# EasyEDA schematic SCH_Mesa Endstops_2022-06-12.json
TITLE: Sheet_1; REV: 1.0; Date: 2022-06-12; Sheet: 1/1; Drawn By: Edward Niedziejko; Company: Your Company
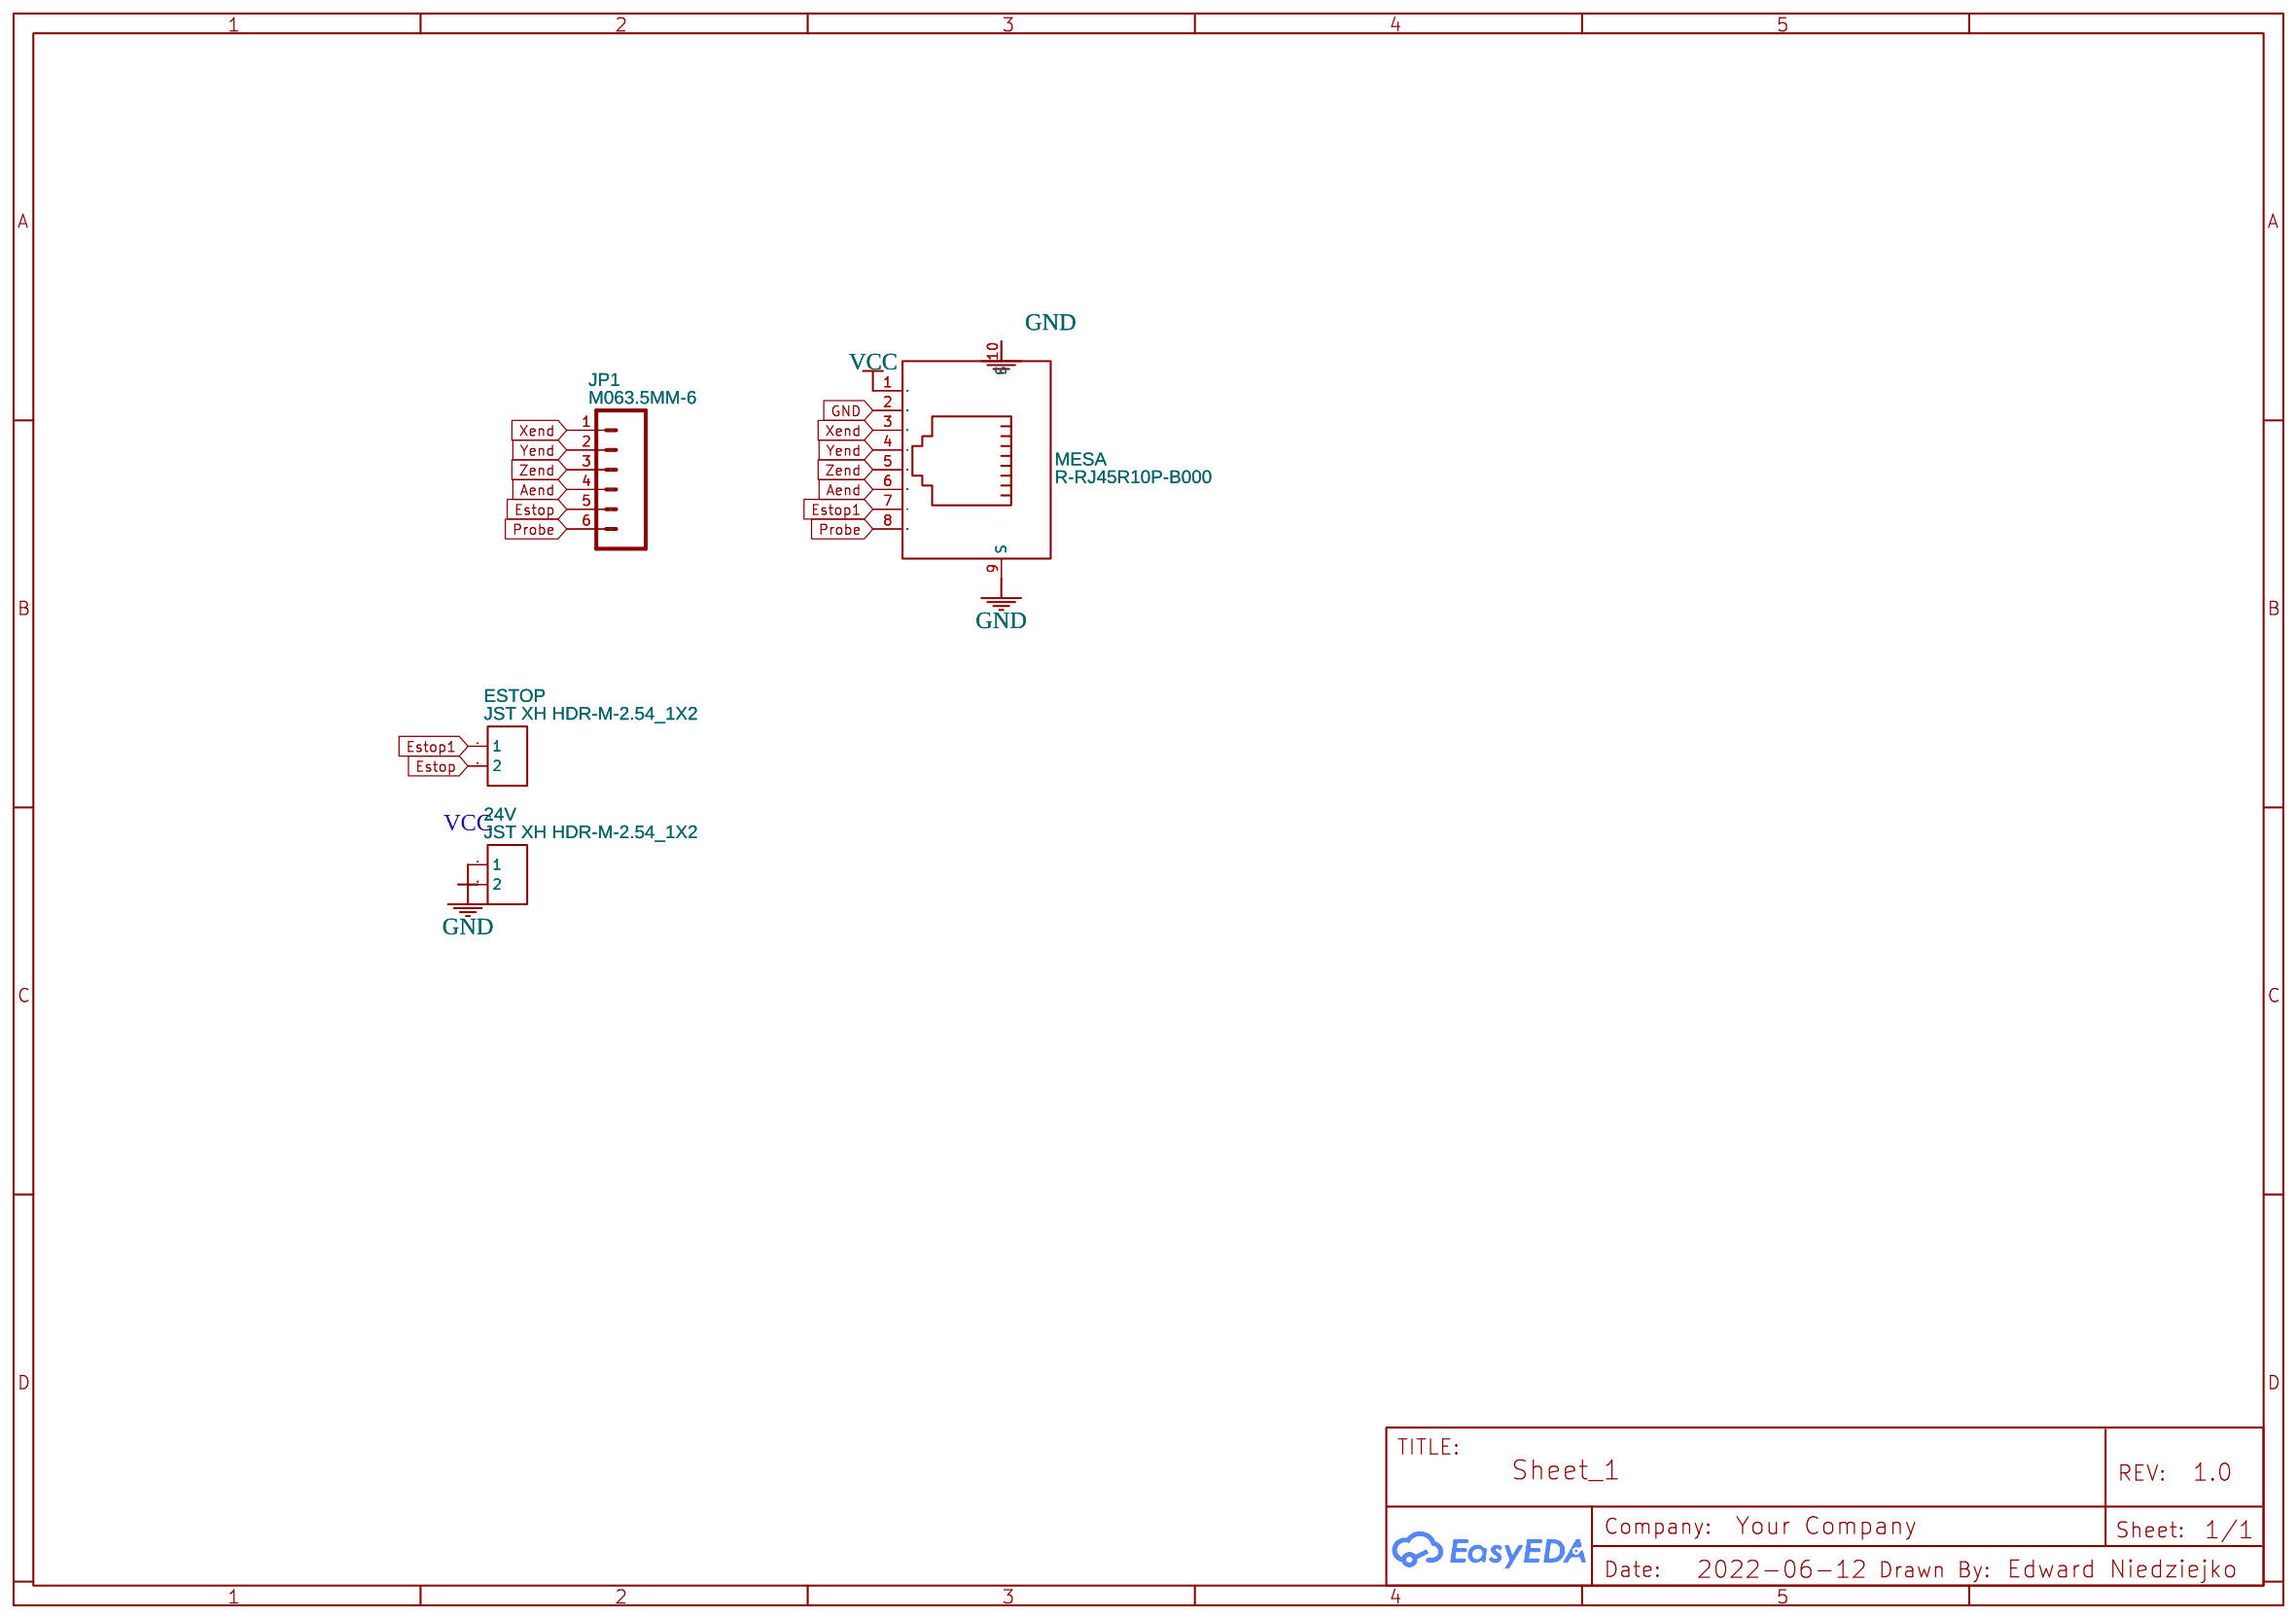
[diagram p0: schematic sheet]

## Parts
24V  JST XH HDR-M-2.54_1X2  [JST-XH-02-PACKAGE-ROUND-PAD]
ESTOP  JST XH HDR-M-2.54_1X2  [JST-XH-02-PACKAGE-ROUND-PAD]
JP1  M063.5MM-6  [SCREWTERMINAL-3.5MM-6]
MESA  R-RJ45R10P-B000  [RJ45-TH_R-RJ45R10P-B000]

## Library data of the parts
24V ESTOP = JST XH HDR-M-2.54_1X2: Supplier Part: C49661; Supplier: LCSC; Contributor: MAKPOL HAVUZ
JP1 = M063.5MM-6: Header 6; Contributor: SparkFun
MESA = R-RJ45R10P-B000: Supplier: LCSC; Supplier Part: C386758; Manufacturer: Shenzhen Cankemeng; Contributor: LCSC; JLCPCB Part Class: Extended Part

## Nets
GND: 24V.2 MESA.2 MESA.9(S) MESA.10(S)
VCC: 24V.1 MESA.1
Aend: JP1.4 MESA.6
Estop: ESTOP.2 JP1.5
Estop1: ESTOP.1 MESA.7
Probe: JP1.6 MESA.8
Xend: JP1.1 MESA.3
Yend: JP1.2 MESA.4
Zend: JP1.3 MESA.5
